# EAGLE schematic 00A-010 (EAGLE 6.3)
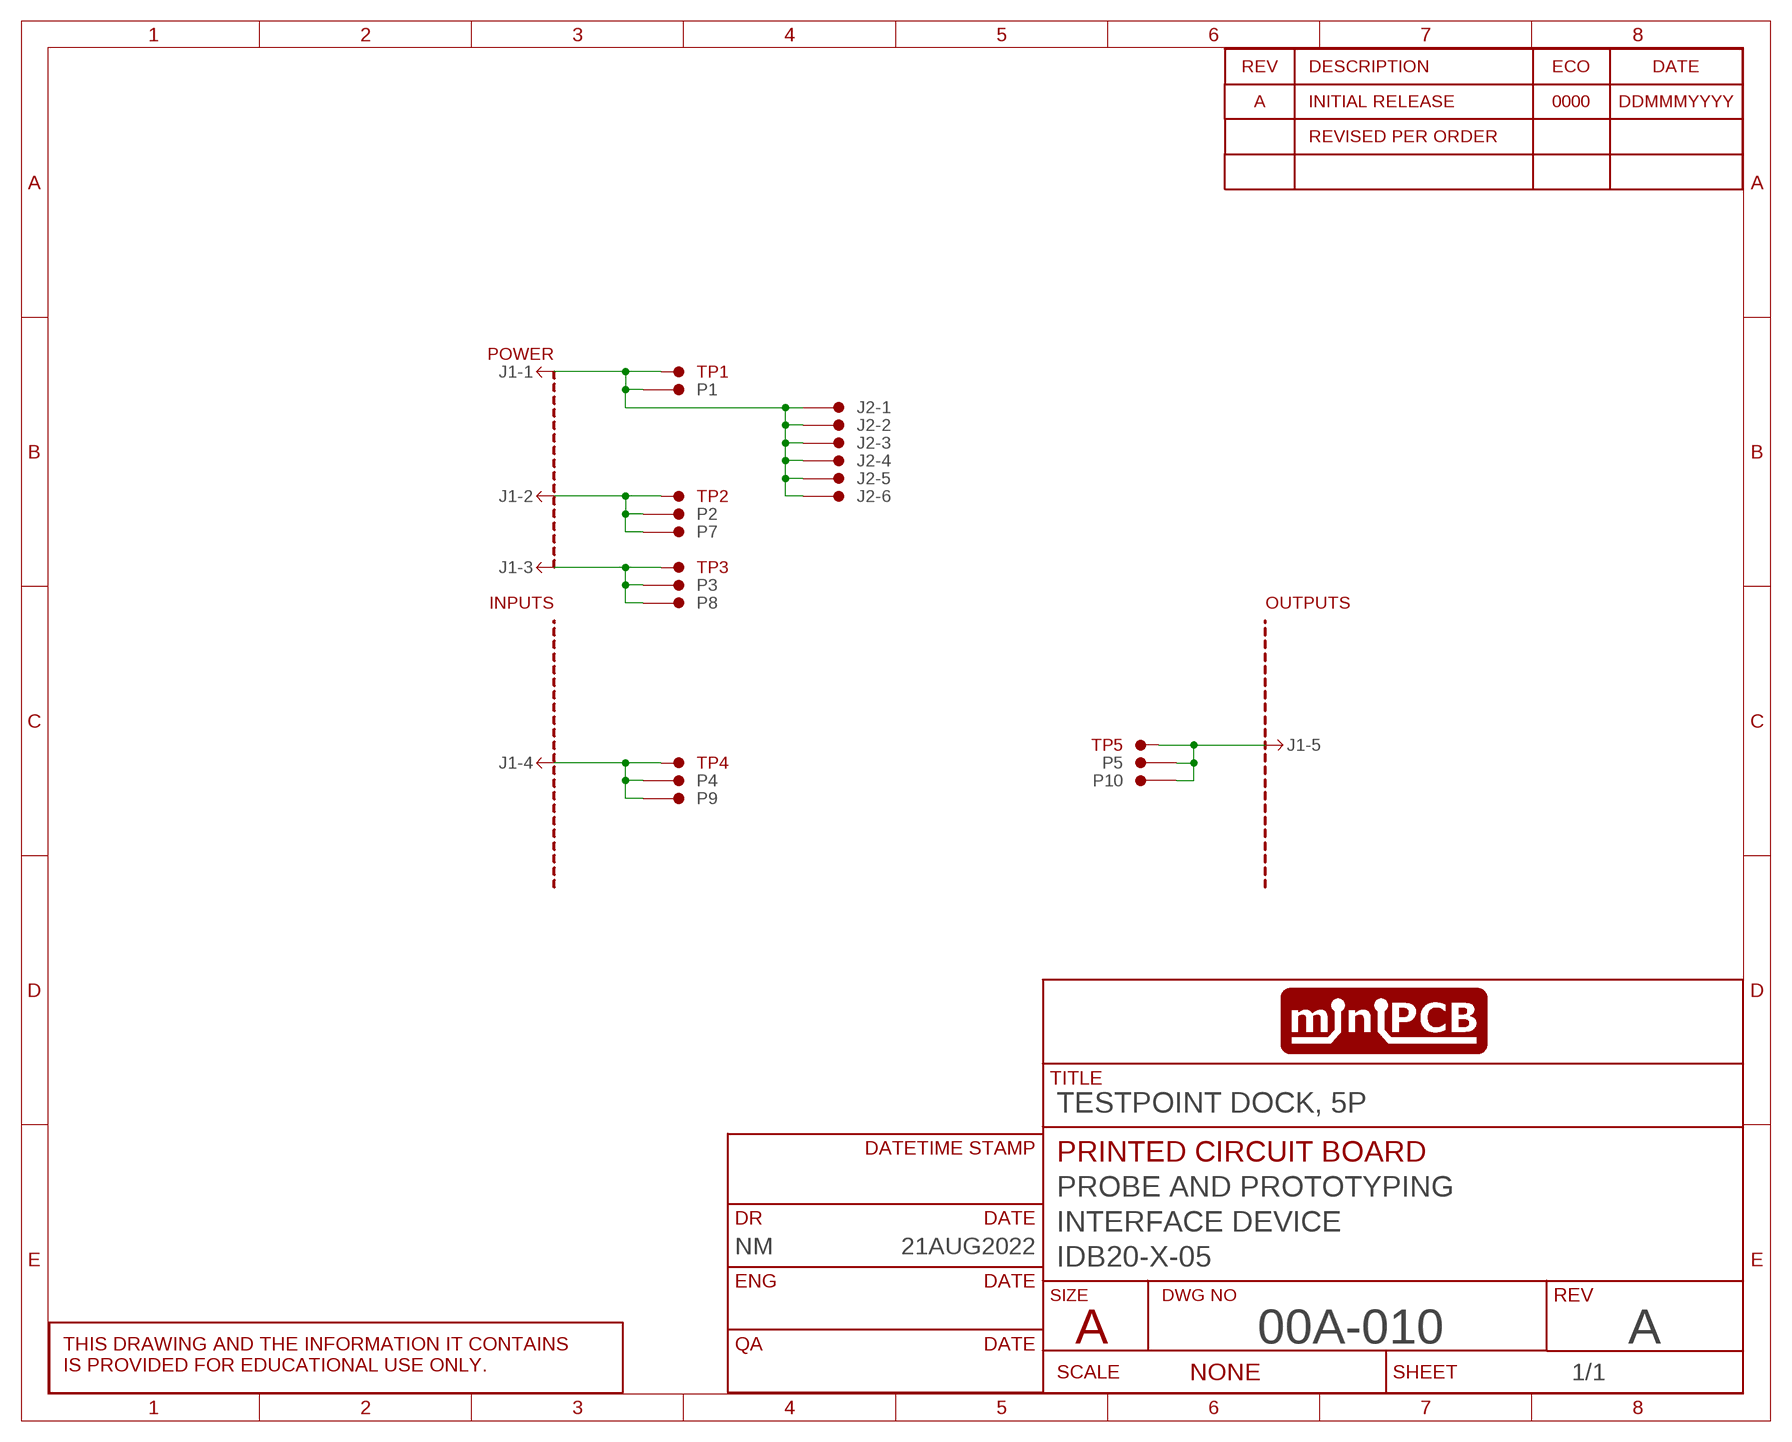
[diagram p0: schematic, sheet 1]
SHEET1 (SCHEMATIC): CIRCUIT_CATEGORY: PROBE AND PROTOTYPING; CIRCUIT_NAME: INTERFACE DEVICE; CIRCUIT_VARIANT: IDB20-X-05; DR: NM; DR_DATE: 21AUG2022; REVA_DATE: DDMMMYYYY; REVA_ECO: 0000; REVB_DESCRIPTION: REVISED PER ORDER; REVISION: A; TITLE: TESTPOINT DOCK, 5P

## Parts
J1  MINIPCB_IDB20-X-05  [MINIPCB_IDB20-X-05]
J2  PINS_6NOTEXT  [PINS_6_NOTEXT]
P1  PINS_124AWG-K  [PINS_1_1MM_K]
P2  PINS_12P  [PINS_2_NOTEXT]
P3  PINS_12P  [PINS_2_NOTEXT]
P4  PINS_12P  [PINS_2_NOTEXT]
P5  PINS_12P  [PINS_2_NOTEXT]
P7  PINS_124AWG-K  [PINS_1_1MM_K]
P8  PINS_124AWG-K  [PINS_1_1MM_K]
P9  PINS_124AWG-K  [PINS_1_1MM_K]
P10  PINS_124AWG-K  [PINS_1_1MM_K]
TP1  TESTPOINTKE5000  [PINS_1_TESTPOINT_KE5000]
TP2  TESTPOINTKE5000  [PINS_1_TESTPOINT_KE5000]
TP3  TESTPOINTKE5000  [PINS_1_TESTPOINT_KE5000]
TP4  TESTPOINTKE5000  [PINS_1_TESTPOINT_KE5000]
TP5  TESTPOINTKE5000  [PINS_1_TESTPOINT_KE5000]

## Nets
N$1: J1.2 P2.1 P2.2 P7.1 P7.2 TP2.1
N$2: J1.1 J2.1 J2.2 J2.3 J2.4 J2.5 J2.6 P1.1 P1.2 TP1.1
N$3: J1.3 P3.1 P3.2 P8.1 P8.2 TP3.1
N$4: J1.4 P4.1 P4.2 P9.1 P9.2 TP4.1
N$5: J1.5 P5.1 P5.2 P10.1 P10.2 TP5.1

## Library data of the parts
J1 = minipcb:MINIPCB_IDB; PART_NUMBER_REV: 00A-010-B
J2 = minipcb:PINS_6
P1-P5 P7-P10 = minipcb:PINS_1
TP1-TP5 = minipcb:TESTPOINT